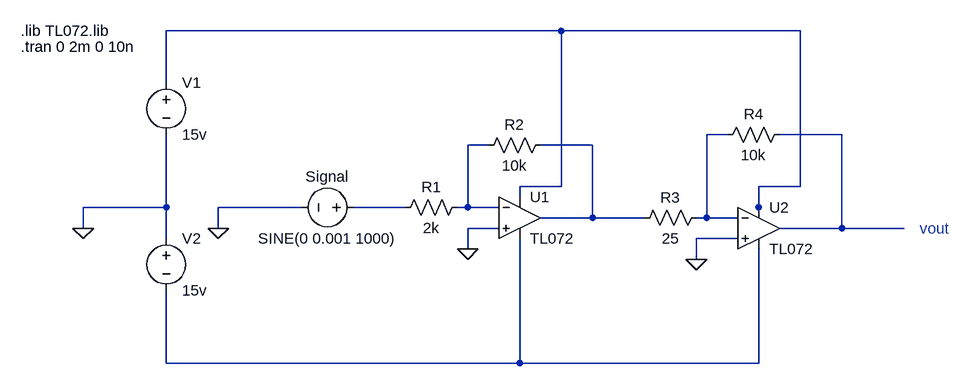
[diagram p0: schematic Gain Stage.asc]
Gain Stage.asc, the LTspice schematic file:
Version 4
SHEET 1 1228 680
WIRE 624 32 16 32
WIRE 992 32 624 32
WIRE 16 112 16 32
WIRE 880 192 848 192
WIRE 1056 192 960 192
WIRE 512 208 480 208
WIRE 672 208 592 208
WIRE 624 272 624 32
WIRE 624 272 560 272
WIRE 992 272 992 32
WIRE 992 272 928 272
WIRE 560 288 560 272
WIRE 16 304 16 192
WIRE 16 304 -112 304
WIRE 224 304 96 304
WIRE 384 304 304 304
WIRE 480 304 480 208
WIRE 480 304 464 304
WIRE 528 304 480 304
WIRE 928 304 928 272
WIRE 672 320 672 208
WIRE 672 320 592 320
WIRE 752 320 672 320
WIRE 848 320 848 192
WIRE 848 320 832 320
WIRE 896 320 848 320
WIRE 928 320 928 304
WIRE -112 336 -112 304
WIRE 96 336 96 304
WIRE 528 336 480 336
WIRE 1056 336 1056 192
WIRE 1056 336 960 336
WIRE 1152 336 1056 336
WIRE 16 352 16 304
WIRE 896 352 832 352
WIRE 480 368 480 336
WIRE 832 384 832 352
WIRE 16 544 16 432
WIRE 560 544 560 352
WIRE 560 544 16 544
WIRE 928 544 928 368
WIRE 928 544 560 544
FLAG 480 368 0
FLAG 832 384 0
FLAG 96 336 0
FLAG -112 336 0
SYMBOL OpAmps/opamp2 560 256 R0
SYMATTR InstName U1
SYMATTR Value TL072
SYMBOL Res 480 288 R90
WINDOW 0 0 56 VBottom 2
WINDOW 3 32 56 VTop 2
SYMATTR InstName R1
SYMATTR Value 2k
SYMBOL Res 608 192 R90
WINDOW 0 0 56 VBottom 2
WINDOW 3 32 56 VTop 2
SYMATTR InstName R2
SYMATTR Value 10k
SYMBOL Voltage 320 304 R90
WINDOW 0 -32 56 VBottom 2
WINDOW 3 32 56 VTop 2
SYMATTR InstName Signal
SYMATTR Value SINE(0 0.001 1000)
SYMATTR SpiceLine Rser=1500
SYMBOL Res 848 304 R90
WINDOW 0 0 56 VBottom 2
WINDOW 3 32 56 VTop 2
SYMATTR InstName R3
SYMATTR Value 25
SYMBOL OpAmps/opamp2 928 272 R0
SYMATTR InstName U2
SYMATTR Value TL072
SYMBOL Res 976 176 R90
WINDOW 0 0 56 VBottom 2
WINDOW 3 32 56 VTop 2
SYMATTR InstName R4
SYMATTR Value 10k
SYMBOL Voltage 16 96 R0
SYMATTR InstName V1
SYMATTR Value 15v
SYMBOL Voltage 16 336 R0
SYMATTR InstName V2
SYMATTR Value 15v
TEXT -208 32 Left 2 !.lib TL072.lib
TEXT -208 56 Left 2 !.tran 0 2m 0 10n
TEXT 1176 336 Left 2 ;vout

The netlist it stands for:
* Gain Stage.asc
XU1 0 N004 N001 N007 N005 TL072  ; pins In+ In- V+ V- OUT
R1 N004 N006 2k
R2 N005 N004 10k
V§Signal N006 0 SINE(0 0.001 1000) Rser=1500
R3 N002 N005 25
XU2 0 N002 N001 N007 N003 TL072  ; pins In+ In- V+ V- OUT
R4 N003 N002 10k
V1 N001 0 15v
V2 0 N007 15v
.lib TL072.lib
.tran 0 2m 0 10n
* vout
.backanno
.end